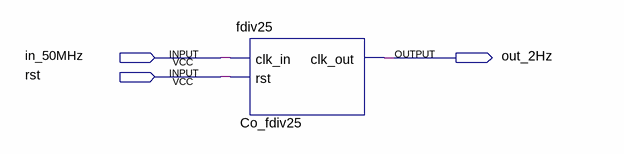
[diagram p0: schematic sheet]
// Quartus schematic fdivisor.bdf as structural Verilog: 1 symbols, 3 pins
module fdivisor (
  input  in_50MHz,
  input  rst,
  output out_2Hz
);

  fdiv25 Co_fdiv25 (.clk_in(in_50MHz), .rst(rst), .clk_out(out_2Hz));
endmodule
